# Altium schematic sheet Sensor.SchDoc: =ProjectName
size A4; CheckedBy: DatNB; Author: Ven; CompanyName: Nacentech; Organization: IMET
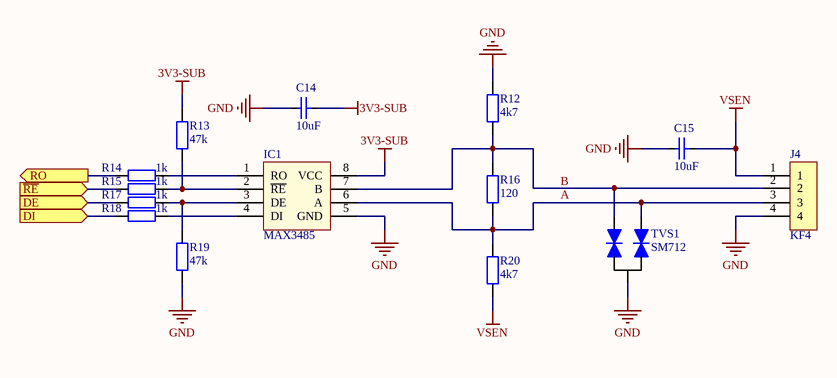
[diagram p0: Sensor.SchDoc]

## Parts
C14  10uF  [CAP_0805]
C15  10uF  [CAP_0805]
IC1  MAX3485  [SO-8]
J4  KF4  [KF4-5.08]
R12  4k7  [RES-SMD-0805]
R13  47k  [RES-SMD-0805]
R14  1k  [RES-SMD-0805]
R15  1k  [RES-SMD-0805]
R16  120  [RES-SMD-0805]
R17  1k  [RES-SMD-0805]
R18  1k  [RES-SMD-0805]
R19  47k  [RES-SMD-0805]
R20  4k7  [RES-SMD-0805]
TVS1  SM712  [SOT23]

## Ports
DE (in), DI (in), RO (out), ~{RE} (in)

## Nets
3V3-SUB: C14.2 IC1.8(VCC) R13.1
GND: C14.1 C15.1 IC1.5(GND) J4.4 R12.2 R19.2 TVS1.3(K)
VSEN: C15.2 J4.1 R20.1
~{RE}: R15.2 ; port ~{RE}
A: IC1.6(A) J4.3 R16.1 R20.2 TVS1.1(A)
DE: R17.2 ; port DE
DI: R18.2 ; port DI
RO: R14.2 ; port RO
NetIC1_1: IC1.1(RO) R14.1
NetIC1_2: IC1.2(~{RE}) R13.2 R15.1
NetIC1_3: IC1.3(DE) R17.1 R19.1
NetIC1_4: IC1.4(DI) R18.1
NetIC1_7: IC1.7(B) J4.2 R12.1 R16.2 TVS1.2(A)

## Notes on the sheet
- Labels drawn without touching a wire or pin: B
- Project:
- Page Contents:
- Size:
- Date:
- A4
- Checked by:
- Time:
- Revision:
- Sheet
- of
- File:

## Library data of the parts
C14 C15 = CapSMD: Capacitor; Value: 33p; Published: 8-Jun-2000; LatestRevisionDate: 17-Jul-2002; LatestRevisionNote: Re-released for DXP Platform.; PackageReference: RAD-0.3; Publisher: Altium Limited
IC1 = MAX485: RS232 - RS485 (Same sn75176)
J4 = KF4: Manufacturer: W¨¹rth Elektronik eiSos GmbH; PartNo: 691133710004; ComponentLink1 Description: Manufacturer; ComponentLink2 Description: Datasheet; NoPins: 4; ComponentLink1 URL: http://www.we-online.com; ComponentLink2 URL: http://katalog.we-online.de/em/datasheet/6911337100xx.pdf; Created By: Baojun Chen; Created Date: 4-Aug-15
R12-R20 = Resistor - SMD: Resistor SMD; Manufacturer: Generic Components; Class: Passive; Published: 08/06/2000; Publisher: Altium Hobart Technology Centre
TVS1 = BAV70: Value: 1N4148